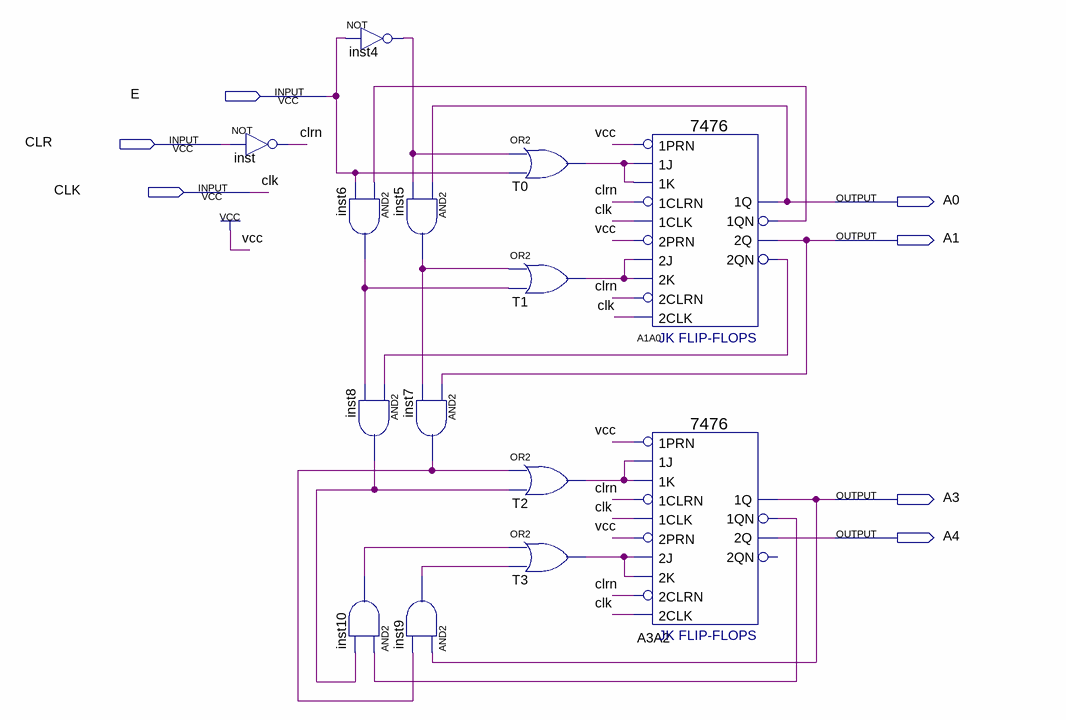
[diagram p0: schematic sheet]
// Quartus schematic Question3.bdf as structural Verilog: 14 symbols, 7 pins
module Question3 (
  input  E,
  input  CLR,
  input  CLK,
  output A0,
  output A1,
  output A3,
  output A4
);

  wire A1A0_1qn, A1A0_2qn, A3A2_1qn, clrn, inst4_out, inst5_out, inst6_out, inst7_out, inst8_out, inst9_out,
       inst10_out, T0_out, T1_out, T2_out, T3_out;

  not inst (clrn, CLR);
  not inst4 (inst4_out, E);
  and inst5 (inst5_out, A0, inst4_out);
  and inst6 (inst6_out, A1A0_1qn, E);
  and inst8 (inst8_out, A1A0_2qn, inst6_out);
  and inst9 (inst9_out, A3, inst7_out);
  and inst10 (inst10_out, A3A2_1qn, inst8_out);
  and inst7 (inst7_out, A1, inst5_out);
  or T0 (T0_out, inst4_out, E);
  or T1 (T1_out, inst5_out, inst6_out);
  or T2 (T2_out, inst7_out, inst8_out);
  or T3 (T3_out, inst10_out, inst9_out);
  \7476  A1A0 (
    .\1J (T0_out), .\1K (T0_out), .\1PRN (1'b1), .\2PRN (1'b1), .\2J (T1_out), .\1CLK (CLK), .\1CLRN (clrn),
    .\2K (T1_out), .\2CLRN (clrn), .\2CLK (CLK), .\2QN (A1A0_2qn), .\1Q (A0), .\2Q (A1), .\1QN (A1A0_1qn));
  \7476  A3A2 (
    .\1J (T2_out), .\1K (T2_out), .\1PRN (1'b1), .\2PRN (1'b1), .\2J (T3_out), .\1CLK (CLK), .\1CLRN (clrn),
    .\2K (T3_out), .\2CLRN (clrn), .\2CLK (CLK), .\1Q (A3), .\2Q (A4), .\1QN (A3A2_1qn));  // open: 2QN
endmodule
